# Altium schematic sheet Connections&Ports.SchDoc
size B
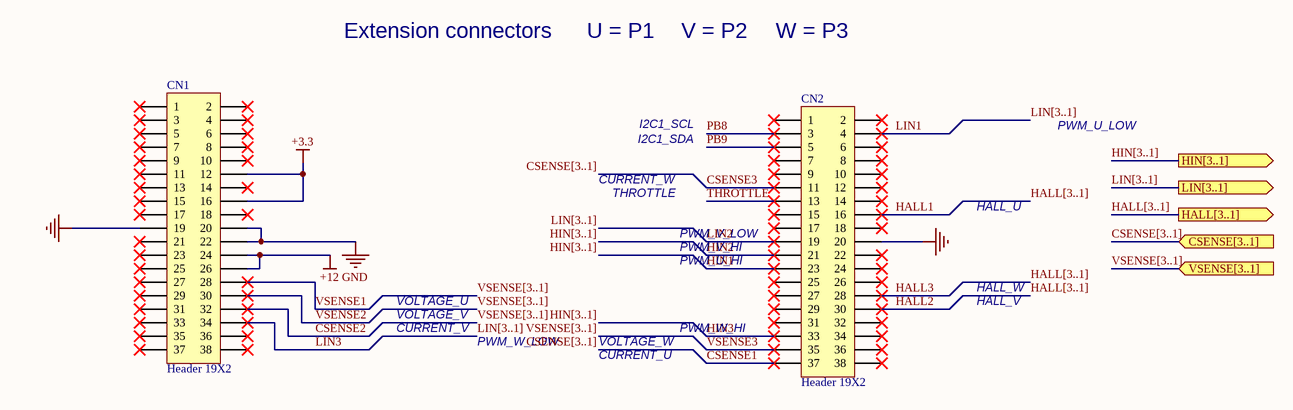
[diagram p0: Connections&Ports.SchDoc]

## Parts
CN1  Header 19X2  [HDR2X19]
CN2  Header 19X2  [HDR2X19]

## Ports
CSENSE[3..1] (in), HALL[3..1] (out), HIN[3..1] (out), LIN[3..1] (out), VSENSE[3..1] (in)

## Nets
+3.3: CN1.12 CN1.16
+12: CN1.24 CN1.26
GND: CN1.19 CN1.20 CN1.22 CN2.20
CSENSE1: CN2.37
CSENSE2: CN1.32
CSENSE3: CN2.11
HALL1: CN2.16
HALL2: CN2.30
HALL3: CN2.28
HIN1: CN2.23
HIN2: CN2.21
HIN3: CN2.33
LIN1: CN2.4
LIN2: CN2.19
LIN3: CN1.34
PB8: CN2.3
PB9: CN2.5
THROTTLE: CN2.13
VSENSE1: CN1.28
VSENSE2: CN1.30
VSENSE3: CN2.35

Not connected (* = marked no-connect by the designer): CN1 1* 2* 3* 4* 5* 6* 7* 8* 9* 10* 11* 13* 14* 15* 17* 18* 21* 23* 25* 27* 29* 31* 33* 35* 36* 37* 38*; CN2 1* 2* 6* 7* 8* 9* 10* 12* 14* 15* 17* 18* 22* 24* 25* 26* 27* 29* 31* 32* 34* 36* 38*

## Buses and harness runs
bus CSENSE[3..1]
bus CSENSE[3..1] = port CSENSE[3..1]
bus HALL[3..1]
bus HALL[3..1] = port HALL[3..1]
bus HIN[3..1]
bus HIN[3..1] = port HIN[3..1]
bus LIN[3..1]
bus LIN[3..1] = port LIN[3..1]
bus VSENSE[3..1]
bus VSENSE[3..1] = port VSENSE[3..1]

## Notes on the sheet
- Extension connectors
- U = P1
- V = P2
- W = P3
- I2C1_SDA
- I2C1_SCL
- PWM_U_LOW
- CURRENT_W
- THROTTLE
- PWM_V_LOW
- HALL_U
- VOLTAGE_U
- PWM_U_HI
- PWM_V_HI
- HALL_V
- HALL_W
- VOLTAGE_V
- CURRENT_V
- PWM_W_LOW
- VOLTAGE_W
- CURRENT_U
- PWM_W_HI
- Title
- Date:
- Revision:
- Number:
- Team Skytanic
- Sheet
- of
- Senior Design
- 2019/2020
- File:

## Library data of the parts
CN1 CN2 = Header 19X2: Header, 19-Pin, Dual row; Revision: 17-Jul-2002: Re-released for DXP Platform.; Publisher: Altium Limited